# EAGLE schematic preamp (EAGLE 6.4)
DATABASE: ../partsdb.txt
Assembly variants: Full, No-EQ, No-EQ-No-XLR
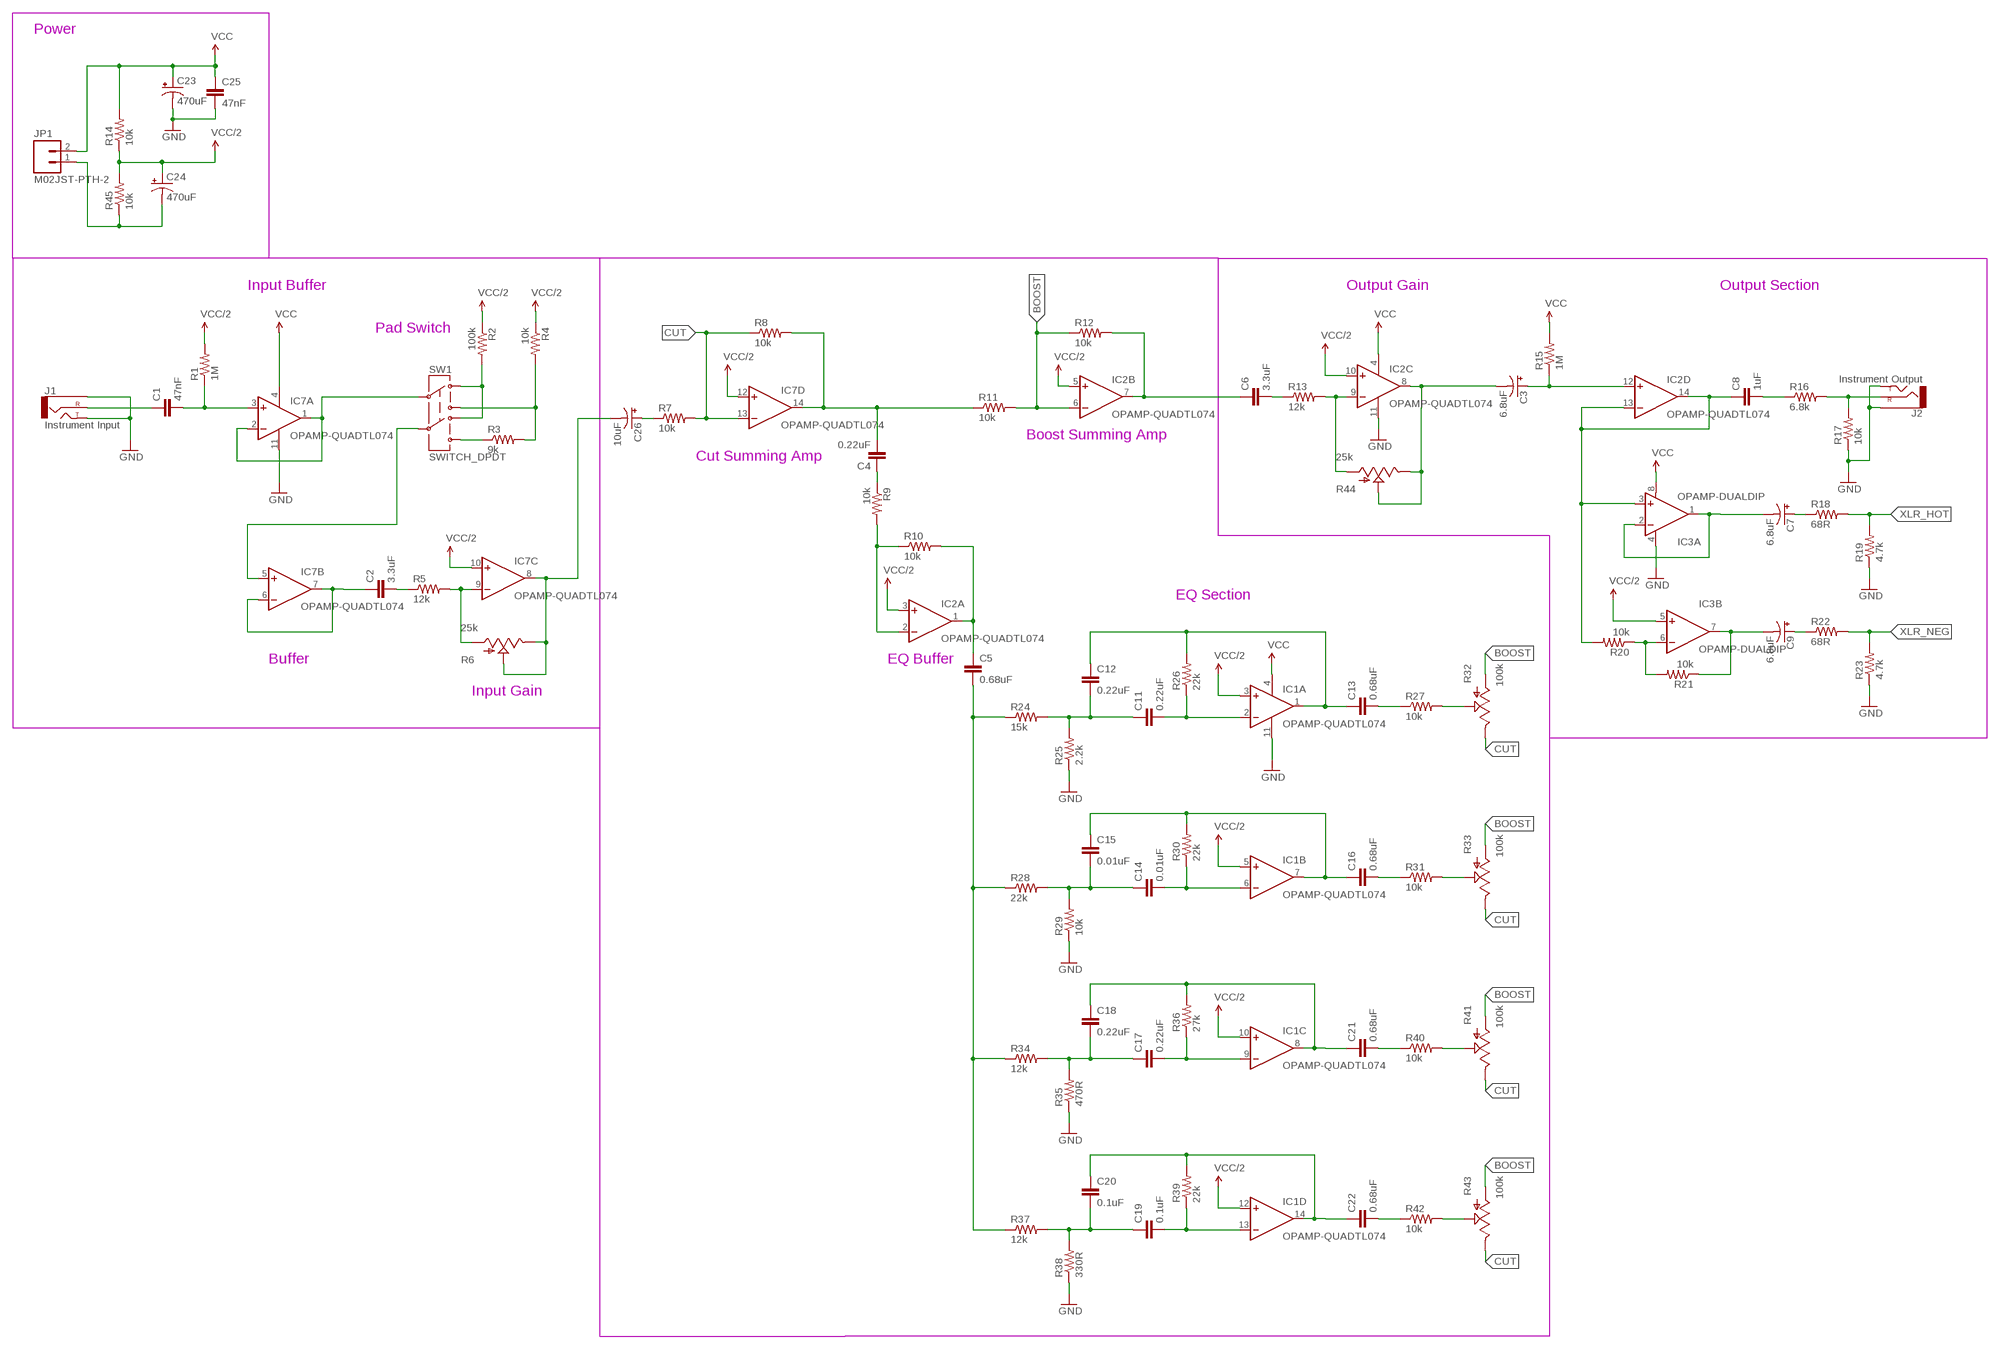
[diagram p0: schematic, sheet 1]

## Parts
C1  47nF  CAP  [CAP-5MM]
C2  3.3uF  CAP  [CAP-5MM]
C3  6.8uF  CAP_POLPTH2  [CPOL-RADIAL-10UF-25V]
C4  0.22uF  CAP  [CAP-5MM]  (not fitted in variant No-EQ)  (not fitted in variant No-EQ-No-XLR)
C5  0.68uF  CAP  [CAP-5MM]  (not fitted in variant No-EQ)  (not fitted in variant No-EQ-No-XLR)
C6  3.3uF  CAP  [CAP-5MM]
C7  6.8uF  CAP_POLPTH2  [CPOL-RADIAL-10UF-25V]  (not fitted in variant No-EQ-No-XLR)
C8  1uF  CAP  [CAP-5MM]
C9  6.8uF  CAP_POLPTH2  [CPOL-RADIAL-10UF-25V]  (not fitted in variant No-EQ-No-XLR)
C11  0.22uF  CAP  [CAP-5MM]  (not fitted in variant No-EQ)  (not fitted in variant No-EQ-No-XLR)
C12  0.22uF  CAP  [CAP-5MM]  (not fitted in variant No-EQ)  (not fitted in variant No-EQ-No-XLR)
C13  0.68uF  CAP  [CAP-5MM]  (not fitted in variant No-EQ)  (not fitted in variant No-EQ-No-XLR)
C14  0.01uF  CAP  [CAP-5MM]  (not fitted in variant No-EQ)  (not fitted in variant No-EQ-No-XLR)
C15  0.01uF  CAP  [CAP-5MM]  (not fitted in variant No-EQ)  (not fitted in variant No-EQ-No-XLR)
C16  0.68uF  CAP  [CAP-5MM]  (not fitted in variant No-EQ)  (not fitted in variant No-EQ-No-XLR)
C17  0.22uF  CAP  [CAP-5MM]  (not fitted in variant No-EQ)  (not fitted in variant No-EQ-No-XLR)
C18  0.22uF  CAP  [CAP-5MM]  (not fitted in variant No-EQ)  (not fitted in variant No-EQ-No-XLR)
C19  0.1uF  CAP  [CAP-5MM]  (not fitted in variant No-EQ)  (not fitted in variant No-EQ-No-XLR)
C20  0.1uF  CAP  [CAP-5MM]  (not fitted in variant No-EQ)  (not fitted in variant No-EQ-No-XLR)
C21  0.68uF  CAP  [CAP-5MM]  (not fitted in variant No-EQ)  (not fitted in variant No-EQ-No-XLR)
C22  0.68uF  CAP  [CAP-5MM]  (not fitted in variant No-EQ)  (not fitted in variant No-EQ-No-XLR)
C23  470uF  CAP_POLPTH1  [CPOL-RADIAL-100UF-25V]
C24  470uF  CAP_POLPTH1  [CPOL-RADIAL-100UF-25V]
C25  47nF  CAP  [CAP-5MM]
C26  10uF  CAP_POLPTH2  [CPOL-RADIAL-10UF-25V]
IC1  OPAMP-QUADTL074  [DIP14]
IC2  OPAMP-QUADTL074  [DIP14]
IC3  OPAMP-DUALDIP  [DIP08]  (not fitted in variant No-EQ-No-XLR)
IC7  OPAMP-QUADTL074  [DIP14]
J1  Instrument Input  AUDIO-JACK  [AUDIO-JACK-RA49B12B]
J2  Instrument Output  AUDIO-JACK  [AUDIO-JACK-RA49B12B]
JP1  M02JST-PTH-2  [JST-2-PTH]
R1  1M  RESISTORPTH-1/4W  [AXIAL-0.4]
R2  100k  RESISTORPTH-1/4W  [AXIAL-0.4]
R3  9k  RESISTORPTH-1/4W  [AXIAL-0.4]
R4  10k  RESISTORPTH-1/4W  [AXIAL-0.4]
R5  12k  RESISTORPTH-1/4W  [AXIAL-0.4]
R6  25k  POTPANA  [POTENTIOMETER-EVUE2A]
R7  10k  RESISTORPTH-1/4W  [AXIAL-0.4]
R8  10k  RESISTORPTH-1/4W  [AXIAL-0.4]
R9  10k  RESISTORPTH-1/4W  [AXIAL-0.4]  (not fitted in variant No-EQ)  (not fitted in variant No-EQ-No-XLR)
R10  10k  RESISTORPTH-1/4W  [AXIAL-0.4]  (not fitted in variant No-EQ)  (not fitted in variant No-EQ-No-XLR)
R11  10k  RESISTORPTH-1/4W  [AXIAL-0.4]
R12  10k  RESISTORPTH-1/4W  [AXIAL-0.4]
R13  12k  RESISTORPTH-1/4W  [AXIAL-0.4]
R14  10k  RESISTORPTH-1/4W  [AXIAL-0.4]
R15  1M  RESISTORPTH-1/4W  [AXIAL-0.4]
R16  6.8k  RESISTORPTH-1/4W  [AXIAL-0.4]
R17  10k  RESISTORPTH-1/4W  [AXIAL-0.4]
R18  68R  RESISTORPTH-1/4W  [AXIAL-0.4]  (not fitted in variant No-EQ-No-XLR)
R19  4.7k  RESISTORPTH-1/4W  [AXIAL-0.4]  (not fitted in variant No-EQ-No-XLR)
R20  10k  RESISTORPTH-1/4W  [AXIAL-0.4]  (not fitted in variant No-EQ-No-XLR)
R21  10k  RESISTORPTH-1/4W  [AXIAL-0.4]  (not fitted in variant No-EQ-No-XLR)
R22  68R  RESISTORPTH-1/4W  [AXIAL-0.4]  (not fitted in variant No-EQ-No-XLR)
R23  4.7k  RESISTORPTH-1/4W  [AXIAL-0.4]  (not fitted in variant No-EQ-No-XLR)
R24  15k  RESISTORPTH-1/4W  [AXIAL-0.4]  (not fitted in variant No-EQ)  (not fitted in variant No-EQ-No-XLR)
R25  2.2k  RESISTORPTH-1/4W  [AXIAL-0.4]  (not fitted in variant No-EQ)  (not fitted in variant No-EQ-No-XLR)
R26  22k  RESISTORPTH-1/4W  [AXIAL-0.4]  (not fitted in variant No-EQ)  (not fitted in variant No-EQ-No-XLR)
R27  10k  RESISTORPTH-1/4W  [AXIAL-0.4]  (not fitted in variant No-EQ)  (not fitted in variant No-EQ-No-XLR)
R28  22k  RESISTORPTH-1/4W  [AXIAL-0.4]  (not fitted in variant No-EQ)  (not fitted in variant No-EQ-No-XLR)
R29  10k  RESISTORPTH-1/4W  [AXIAL-0.4]  (not fitted in variant No-EQ)  (not fitted in variant No-EQ-No-XLR)
R30  22k  RESISTORPTH-1/4W  [AXIAL-0.4]  (not fitted in variant No-EQ)  (not fitted in variant No-EQ-No-XLR)
R31  10k  RESISTORPTH-1/4W  [AXIAL-0.4]  (not fitted in variant No-EQ)  (not fitted in variant No-EQ-No-XLR)
R32  100k  POTBOURNS  [POTENTIOMETER-PTV09A-2020F-B104]  (not fitted in variant No-EQ)  (not fitted in variant No-EQ-No-XLR)
R33  100k  POTBOURNS  [POTENTIOMETER-PTV09A-2020F-B104]  (not fitted in variant No-EQ)  (not fitted in variant No-EQ-No-XLR)
R34  12k  RESISTORPTH-1/4W  [AXIAL-0.4]  (not fitted in variant No-EQ)  (not fitted in variant No-EQ-No-XLR)
R35  470R  RESISTORPTH-1/4W  [AXIAL-0.4]  (not fitted in variant No-EQ)  (not fitted in variant No-EQ-No-XLR)
R36  27k  RESISTORPTH-1/4W  [AXIAL-0.4]  (not fitted in variant No-EQ)  (not fitted in variant No-EQ-No-XLR)
R37  12k  RESISTORPTH-1/4W  [AXIAL-0.4]  (not fitted in variant No-EQ)  (not fitted in variant No-EQ-No-XLR)
R38  330R  RESISTORPTH-1/4W  [AXIAL-0.4]  (not fitted in variant No-EQ)  (not fitted in variant No-EQ-No-XLR)
R39  22k  RESISTORPTH-1/4W  [AXIAL-0.4]  (not fitted in variant No-EQ)  (not fitted in variant No-EQ-No-XLR)
R40  10k  RESISTORPTH-1/4W  [AXIAL-0.4]  (not fitted in variant No-EQ)  (not fitted in variant No-EQ-No-XLR)
R41  100k  POTBOURNS  [POTENTIOMETER-PTV09A-2020F-B104]  (not fitted in variant No-EQ)  (not fitted in variant No-EQ-No-XLR)
R42  10k  RESISTORPTH-1/4W  [AXIAL-0.4]  (not fitted in variant No-EQ)  (not fitted in variant No-EQ-No-XLR)
R43  100k  POTBOURNS  [POTENTIOMETER-PTV09A-2020F-B104]  (not fitted in variant No-EQ)  (not fitted in variant No-EQ-No-XLR)
R44  25k  POTPANA  [POTENTIOMETER-EVUE2A]
R45  10k  RESISTORPTH-1/4W  [AXIAL-0.4]
SW1  SWITCH_DPDT  [SWITCH-EG2211]

## Nets
BOOST: IC2.6(B:IN-) R11.P$2 R12.P$1 R32.3(A) R33.3(A) R41.3(A) R43.3(A)
CUT: IC7.13(D:IN-) R7.P$2 R8.P$1 R32.1(E) R33.1(E) R41.1(E) R43.1(E)
GND: C23.2(-) C25.2 IC1.11(SUP:VEE) IC2.11(SUP:VEE) IC3.4(A:V-) IC7.11(SUP:VEE) J1.S(SLEEVE) J1.T(TIP) J2.S(SLEEVE) J2.T(TIP) R17.P$1 R19.P$1 R23.P$1 R25.P$1 R29.P$1 R35.P$1 R38.P$1
N$1: C1.1 J1.R(RING)
N$2: C1.2 IC7.3(A:IN+) R1.P$1
N$3: IC7.9(C:IN-) R5.P$2 R6.1(A)
N$4: R2.P$2 SW1.L1 SW1.L2
N$5: IC7.5(B:IN+) SW1.C2
N$6: R3.P$2 R4.P$2 SW1.R1
N$7: R3.P$1 SW1.R2
N$8: C2.1 IC7.6(B:IN-) IC7.7(B:OUT)
N$9: C2.2 R5.P$1
N$10: C26.2(-) IC7.8(C:OUT) R6.2(S) R6.3(E)
N$11: IC2.9(C:IN-) R13.P$2 R44.1(A)
N$12: C26.1(+) R7.P$1
N$13: C4.2 IC7.14(D:OUT) R8.P$2 R11.P$1
N$14: C4.1 R9.P$1
N$15: IC2.2(A:IN-) R9.P$2 R10.P$1
N$16: C5.1 IC2.1(A:OUT) R10.P$2
N$17: C6.1 IC2.7(B:OUT) R12.P$2
N$18: C6.2 R13.P$1
N$19: C5.2 R24.P$1 R28.P$1 R34.P$1 R37.P$1
N$20: C3.2(-) IC2.8(C:OUT) R44.2(S) R44.3(E)
N$21: C3.1(+) IC2.12(D:IN+) R15.P$1
N$22: C8.1 IC2.13(D:IN-) IC2.14(D:OUT) IC3.3(A:+IN) R20.P$2
N$23: C8.2 R16.P$1
N$24: J2.R(RING) R16.P$2 R17.P$2
N$25: C7.2(-) IC3.1(A:OUT) IC3.2(A:-IN)
N$26: C7.1(+) R18.P$1
N$28: IC3.6(B:-IN) R20.P$1 R21.P$2
N$29: C9.2(-) IC3.7(B:OUT) R21.P$1
N$30: C9.1(+) R22.P$1
N$32: C11.2 IC1.2(A:IN-) R26.P$1
N$33: C12.1 C13.1 IC1.1(A:OUT) R26.P$2
N$34: C11.1 C12.2 R24.P$2 R25.P$2
N$35: C13.2 R27.P$1
N$36: C14.2 IC1.6(B:IN-) R30.P$1
N$37: C15.1 C16.1 IC1.7(B:OUT) R30.P$2
N$38: C14.1 C15.2 R28.P$2 R29.P$2
N$39: R27.P$2 R32.2(S)
N$40: C16.2 R31.P$1
N$41: R31.P$2 R33.2(S)
N$42: C17.2 IC1.9(C:IN-) R36.P$1
N$43: C18.1 C21.1 IC1.8(C:OUT) R36.P$2
N$44: C17.1 C18.2 R34.P$2 R35.P$2
N$45: C19.2 IC1.13(D:IN-) R39.P$1
N$46: IC7.1(A:OUT) IC7.2(A:IN-) SW1.C1
N$47: C19.1 C20.2 R37.P$2 R38.P$2
N$48: C24.2(-) JP1.1 R45.P$1
N$49: C21.2 R40.P$1
N$50: R40.P$2 R41.2(S)
N$51: C20.1 C22.1 IC1.14(D:OUT) R39.P$2
N$52: C22.2 R42.P$1
N$53: R42.P$2 R43.2(S)
VCC: C23.1(+) C25.1 IC1.4(SUP:VCC) IC2.4(SUP:VCC) IC3.8(A:V+) IC7.4(SUP:VCC) JP1.2 R14.P$2 R15.P$2
VCC/2: C24.1(+) IC1.3(A:IN+) IC1.5(B:IN+) IC1.10(C:IN+) IC1.12(D:IN+) IC2.3(A:IN+) IC2.5(B:IN+) IC2.10(C:IN+) IC3.5(B:+IN) IC7.10(C:IN+) IC7.12(D:IN+) R1.P$2 R2.P$1 R4.P$1 R14.P$1 R45.P$2
XLR_HOT: R18.P$2 R19.P$2
XLR_NEG: R22.P$2 R23.P$2

## Notes on the sheet
- Power
- Input Buffer | Output Gain | Output Section
- Pad Switch
- Boost Summing Amp
- Cut Summing Amp
- EQ Section
- Buffer | EQ Buffer
- Input Gain

## Library data of the parts
C1 C25 = preamp:CAP; PARTNO: FK28X7R1H473K
C2 C6 = preamp:CAP; PARTNO: FK28X5R1A335K
C3 C7 C9 = SparkFun-Capacitors:CAP_POL: Capacitor Polarized These are standard SMD and PTH capacitors. Normally 10uF, 47uF, and 100uF in electrolytic and tantalum varieties. Always verify the external diameter of the through hole cap, it varies with capacity, voltage, and manufacturer. The EIA devices should be standard.; PARTNO: ESH685M063AC3AA
C4 C11 C12 C17 C18 = preamp:CAP; PARTNO: FK28X7R1C224K
C5 C13 C16 C21 C22 = preamp:CAP; PARTNO: FK28X5R1A684K
C8 C14 C15 C19 C20 = preamp:CAP
C23 C24 = SparkFun-Passives:CAP_POL: Capacitor Polarized These are standard SMD and PTH capacitors. Normally 10uF, 47uF, and 100uF in electrolytic and tantalum varieties. Always verify the external diameter of the through hole cap, it varies with capacity, voltage, and manufacturer. The EIA devices should be standard.
C26 = SparkFun-Capacitors:CAP_POL: Capacitor Polarized These are standard SMD and PTH capacitors. Normally 10uF, 47uF, and 100uF in electrolytic and tantalum varieties. Always verify the external diameter of the through hole cap, it varies with capacity, voltage, and manufacturer. The EIA devices should be standard.
IC1 IC2 IC7 = Op Amps:OPAMP-QUAD: Operational amplifier, quad; PARTNO: TL074CN; SPICE: X{NAME}A {A.IN+.NET} {A.IN-.NET} {VCC.NET} {VEE.NET} {A.OUT.NET} TL074\nX{NAME}B {B.IN+.NET} {B.IN-.NET} {VCC.NET} {VEE.NET} {B.OUT.NET} TL074\nX{NAME}C {C.IN+.NET} {C.IN-.NET} {VCC.NET} {VEE.NET} {C.OUT.NET} TL074\nX{NAME}D {D.IN+.NET} {D.IN-.NET} {VCC.NET} {VEE.NET} {D.OUT.NET} TL074; SPICEMOD: .SUBCKT TL074 1 2 3 4 5\nC1 11 12 3.498E-12\nC2 6 7 15.00E-12\nDC 5 53 DX\nDE 54 5 DX\nDLP 90 91 DX\nDLN 92 90 DX\nDP 4 3 DX\nEGND 99 0 POLY(2) (3,0) (4,0) 0 .5 .5\nFB 7 99 POLY(5) VB VC VE VLP VLN 0 4.715E6 -5E6 5E6 5E6 -5E6\nGA 6 0 11 12 282.8E-6\nGCM 0 6 10 99 8.942E-9\nISS 3 10 DC 195.0E-6\nHLIM 90 0 VLIM 1K\nJ1 11 2 10 JX\nJ2 12 1 10 JX\nR2 6 9 100.0E3\nRD1 4 11 3.536E3\nRD2 4 12 3.536E3\nRO1 8 5 150\nRO2 7 99 150\nRP 3 4 2.143E3\nRSS 10 99 1.026E6\nVB 9 0 DC 0\nVC 3 53 DC 2.200\nVE 54 4 DC 2.200\nVLIM 7 8 DC 0\nVLP 91 0 DC 25\nVLN 0 92 DC 25\n.MODEL DX D(IS=800.0E-18)\n.MODEL JX PJF(IS=15.00E-12 BETA=270.1E-6 VTO=-1)\n.ENDS
IC3 = SparkFun-AnalogIC:OPAMP-DUAL: Generic op-amp footprint; PARTNO: TL072IP
J1 J2 = preamp:AUDIO-JACK
JP1 = SparkFun-Connectors:M02: Standard 2-pin 0.1" header. Use with - straight break away headers ( PRT-00116) - right angle break away headers (PRT-00553) - swiss pins (PRT-00743) - machine pins (PRT-00117) - female headers (PRT-00115) Molex polarized connector foot print use with: PRT-08233 with associated crimp pins and housings. 2.54_SCREWTERM for use with PRT-10571. 3.5mm Screw Terminal footprints for PRT-08084 5mm Screw Terminal footprints for use with PRT-08433
R1 R15 = SparkFun-Passives:RESISTOR: Resistor Basic schematic elements and footprints for 0603, 1206, and PTH resistors.; PARTNO: CF14JT1M00
R2 = SparkFun-Passives:RESISTOR: Resistor Basic schematic elements and footprints for 0603, 1206, and PTH resistors.; PARTNO: CF14JT100K
R3 = SparkFun-Passives:RESISTOR: Resistor Basic schematic elements and footprints for 0603, 1206, and PTH resistors.; PARTNO: CF14JT9K10
R4 R7-R12 R14 R17 R20 R21 R27 R29 R31 R40 R42 R45 = SparkFun-Passives:RESISTOR: Resistor Basic schematic elements and footprints for 0603, 1206, and PTH resistors.; PARTNO: CF14JT10K0
R5 R13 R34 R37 = SparkFun-Passives:RESISTOR: Resistor Basic schematic elements and footprints for 0603, 1206, and PTH resistors.; PARTNO: CF14JT12K0
R6 R44 = preamp:POT; PARTNO: EVU-E2AF25D24
R16 = SparkFun-Passives:RESISTOR: Resistor Basic schematic elements and footprints for 0603, 1206, and PTH resistors.; PARTNO: CF14JT6K80
R18 R22 = SparkFun-Passives:RESISTOR: Resistor Basic schematic elements and footprints for 0603, 1206, and PTH resistors.; PARTNO: CF14JT68R0
R19 R23 = SparkFun-Passives:RESISTOR: Resistor Basic schematic elements and footprints for 0603, 1206, and PTH resistors.; PARTNO: CF14JT4K70
R24 = SparkFun-Passives:RESISTOR: Resistor Basic schematic elements and footprints for 0603, 1206, and PTH resistors.; PARTNO: CF14JT15K0
R25 = SparkFun-Passives:RESISTOR: Resistor Basic schematic elements and footprints for 0603, 1206, and PTH resistors.; PARTNO: CF14JT2K20
R26 R28 R30 R39 = SparkFun-Passives:RESISTOR: Resistor Basic schematic elements and footprints for 0603, 1206, and PTH resistors.; PARTNO: CF14JT22K0
R32 R33 R41 R43 = preamp:POT; PARTNO: PTV09A-2020F-B104
R35 R36 R38 = SparkFun-Passives:RESISTOR: Resistor Basic schematic elements and footprints for 0603, 1206, and PTH resistors.
SW1 = preamp:SWITCH_DPDT